# EAGLE design converter (EAGLE 7.4.0)
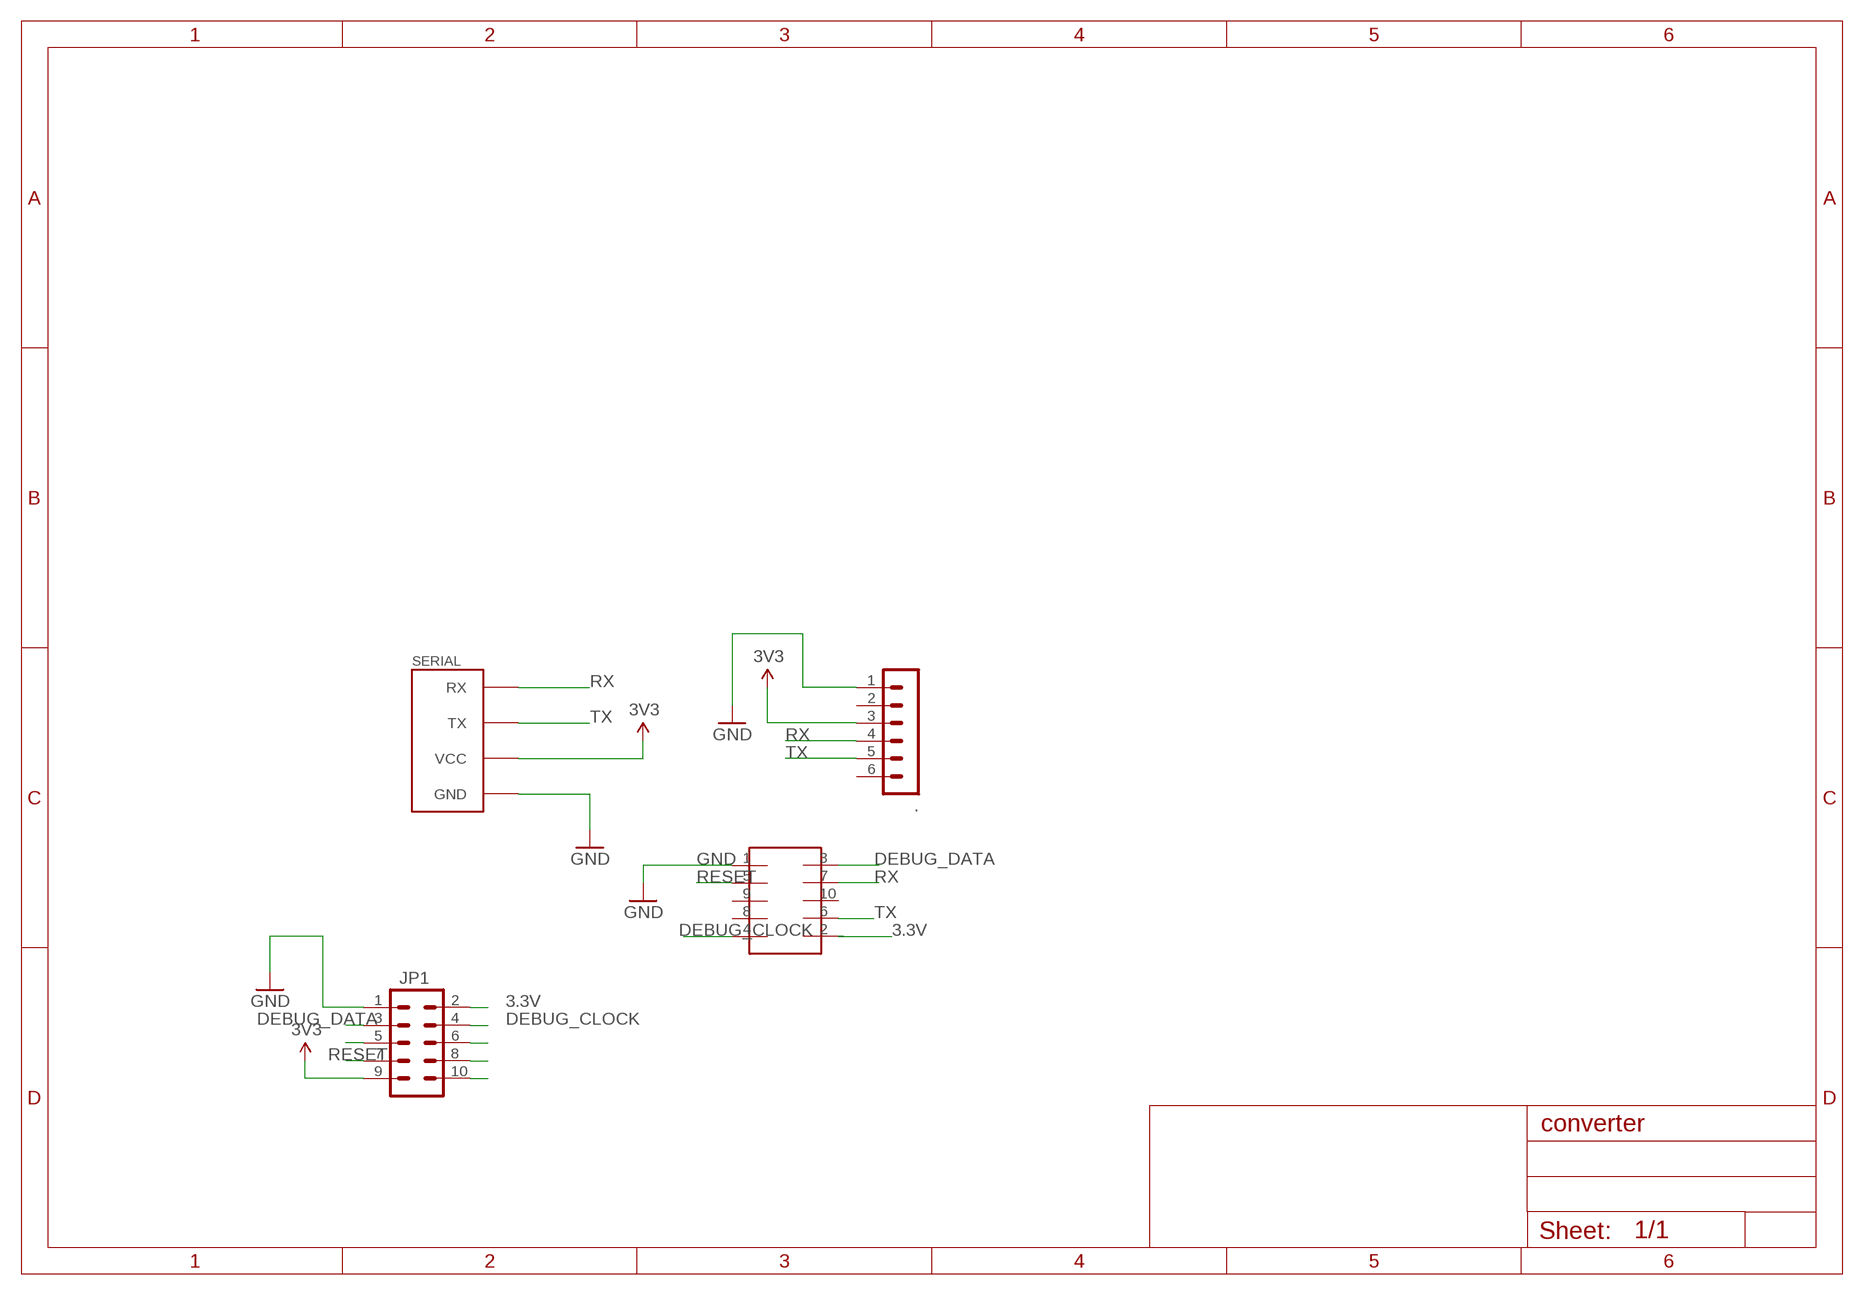
[diagram p0: schematic, sheet 1]

## Parts
.  MA06-1  [MA06-1]
JP1  M05X2SHD  [2X5-SHROUDED]
SERIAL  FABO_BRICK_SERIAL-CONNECTOR_I  [FABO_BRICK_SERIAL_CONNECTOR_I]
U$4  TC-2050-SOCKET  [TC-2050-SOCKET]

## Nets
3.3V: JP1.2 U$4.2
3V3: ..3 JP1.9 SERIAL.VCC
CSN: JP1.5
DEBUG_CLOCK: JP1.4 U$4.4
DEBUG_DATA: JP1.3 U$4.3
GND: ..1 JP1.1 SERIAL.GND U$4.1
MISO: JP1.10
MOSI: JP1.8
RESET: JP1.7 U$4.5
RX: ..4 SERIAL.RX U$4.7
SCLK: JP1.6
TX: ..5 SERIAL.TX U$4.6
Unconnected: ..2 ..6 U$4.8 U$4.9 U$4.10

## Library data of the parts
. = con-lstb:MA06-1: PIN HEADER; OC_FARNELL: unknown; OC_NEWARK: unknown
JP1 = SparkFun-Connectors:M05X2: Header 5x2 Standard 10-pin dual row 0.1" header. Commonly used with AVR-ISP. Use with Spark Fun Electronics SKU: PRT-00778
SERIAL = FaBo-Template:FABO_BRICK_SERIAL: FaBo Brick Serial
U$4 = GClue-Debbuger:TC-2050-SOCKET

## Board
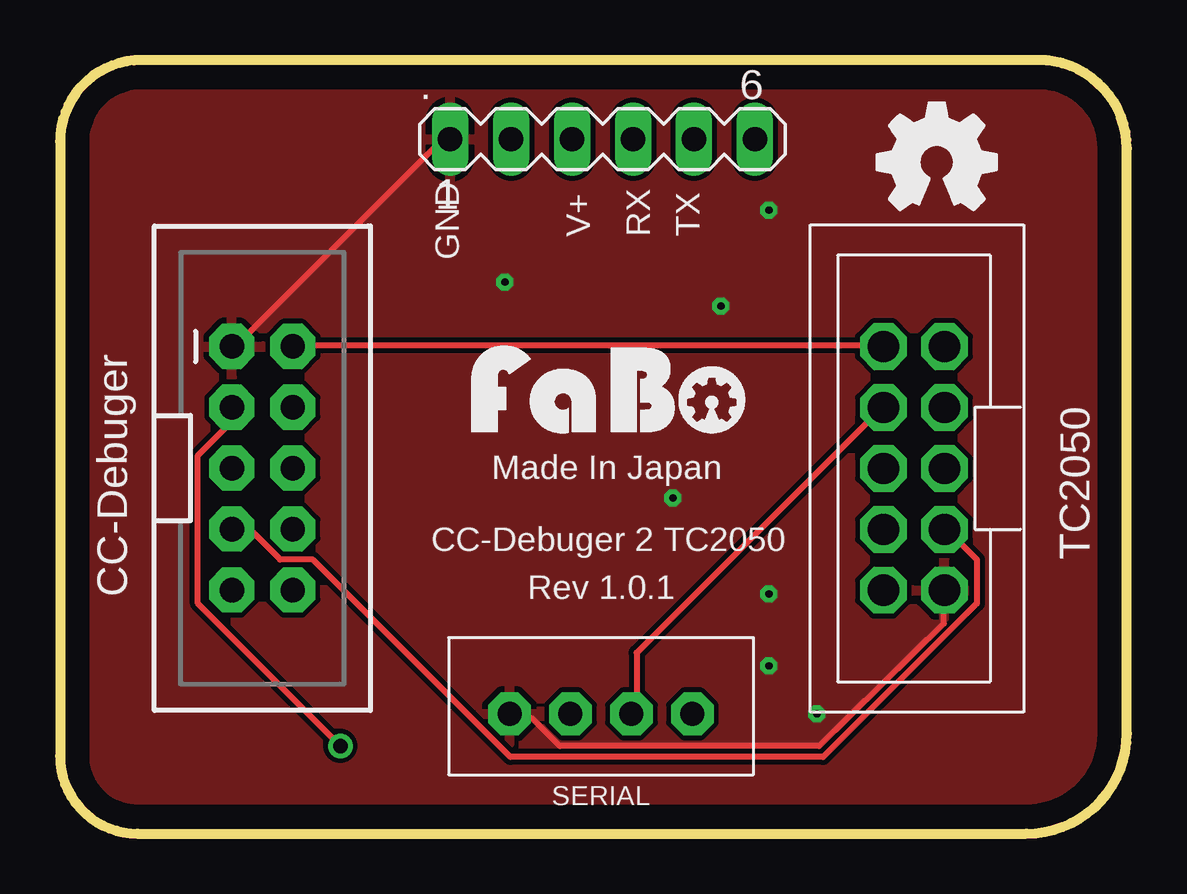
[diagram p1: board, top side]
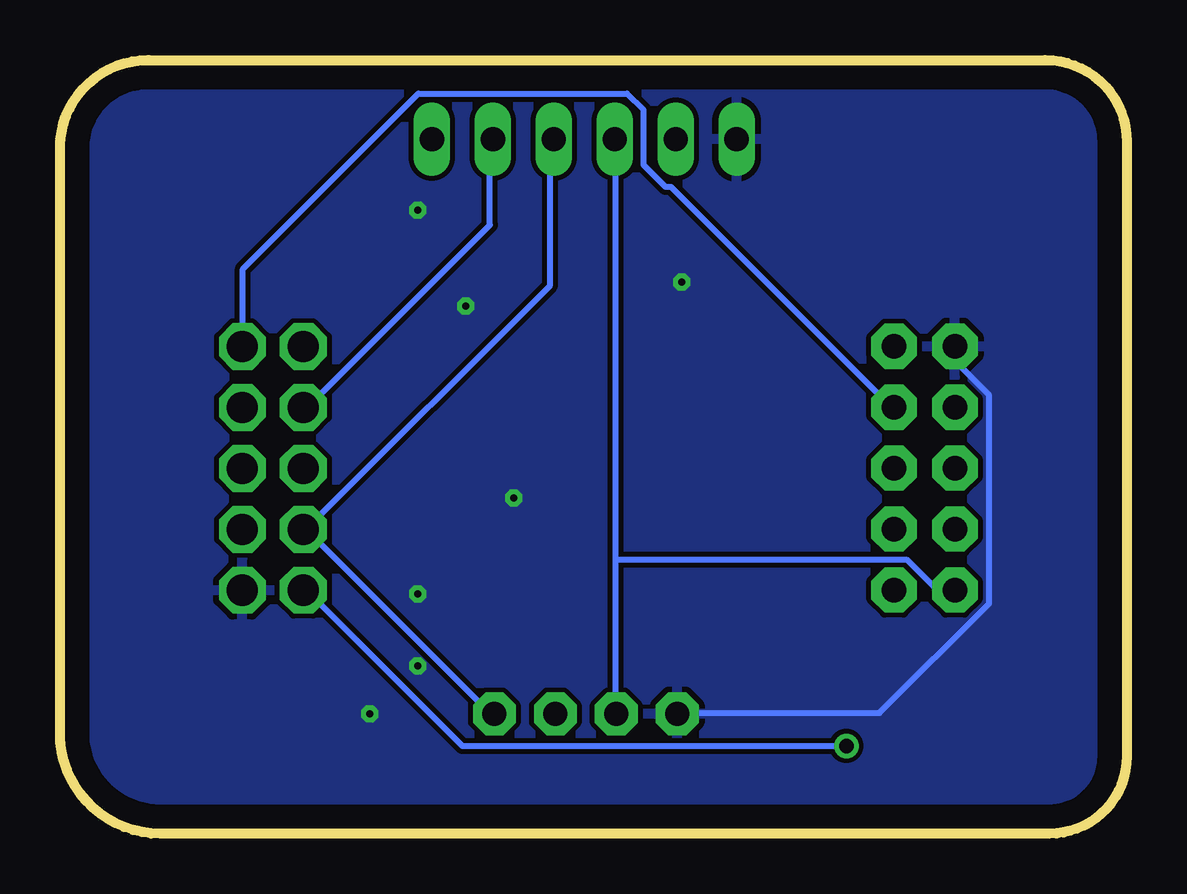
[diagram p2: board, bottom side, seen from below]

Size 44.45 x 32.26 mm. Coordinates in mm from the lower left corner, seen from the top.
Outline: 3.23,0 40.27,0 arc90 44.45,4.18 44.45,28.57 arc90 40.77,32.26 3.4,32.26 arc90 0,28.86 0,3.23 arc90 3.23,0
Copper layers (1*16): Top 0.035mm / dielectric 1.5mm / Bottom 0.035mm
Design rules "default": minimum track width 10mil, minimum drill 24mil, track to track 8mil, track to pad 8mil, pad to pad 8mil, via to via 8mil, smd to smd 8mil, copper to edge 40mil, drill to drill 8mil, minimum pad ring 10mil, minimum via ring 8mil, stop-mask expansion 4mil, vias tented up to drill 0mil, thermal gap 10mil

### Footprints (pad centres in the part's own frame; a part is rotated, then mirrored left to right if it is on the bottom)
MA06-1 = drill 1.016 long: 1 -6.35,0; 2 -3.81,0; 3 -1.27,0; 4 1.27,0; 5 3.81,0; 6 6.35,0
2X5-SHROUDED = drill 1.016 pad 1.88 octagon: 1 -1.27,5.08; 2 1.27,5.08; 3 -1.27,2.54; 4 1.27,2.54; 5 -1.27,0; 6 1.27,0; 7 -1.27,-2.54; 8 1.27,-2.54; 9 -1.27,-5.08; 10 1.27,-5.08
FABO_BRICK_SERIAL_CONNECTOR_I = drill 1 pad 1.778 octagon: GND -3.81,0; RX 3.81,0; TX 1.27,0; VCC -1.27,0
TC-2050-SOCKET = drill 1.3 octagon: 1 1.27,-8.89; 2 -1.27,1.27; 3 -1.27,-8.89; 4 1.27,1.27; 5 1.27,-6.35; 6 -1.27,-1.27; 7 -1.27,-6.35; 8 1.27,-1.27; 9 1.27,-3.81; 10 -1.27,-3.81

### Placement (x,y rotation side)
.  22.61,28.96 0 top
JP1  8.43,15.24 0 top
SERIAL  22.54,5 0 top
U$1  [LOGO_FABO_M]  22.86,16.7 0 top
U$2  [LOGO_OSHW_M]  36.54,28 0 top
U$4  35.58,19.04 0 top

### Tracks (layer width: path | path; a pad name or v marks a point on that pad's centre or on a via)
3.3V
  Top 0.254: JP1.2 9.86,20.34 34.09,20.34 U$4.2
3V3
  Bottom 0.254: 21.29,11.43 21.29,5.03 SERIAL.VCC | 21.29,11.43 21.29,28.8 ..3 | 21.29,11.43 9.17,11.43 8.03,10.29 7.34,10.29 JP1.9
DEBUG_CLOCK
  Bottom 0.254: JP1.4 9.86,17.83 19,26.98 19.23,26.98 20.14,27.89 20.14,30.18 20.83,30.86 29.52,30.86 36.83,23.55 36.83,20.34 U$4.4
DEBUG_DATA  (via drill 0.61)
  Top 0.254: v11.68,3.66 5.74,9.6 5.74,15.77 7.11,17.14 7.11,17.6 JP1.3
  Bottom 0.254: v11.68,3.66 27.69,3.66 34.09,10.06 U$4.3
GND  (via drill 0.3)
  Top 0.254: ..1 16.26,28.8 15.8,28.8 7.34,20.34 JP1.1 | SERIAL.GND 18.77,4.8 19.68,4.8 20.83,3.66 31.63,3.66 36.83,8.76 U$4.1
  Bottom 0.254: JP1.1 7.11,20.12 7.11,19.66 5.74,18.29 5.74,9.6 10.31,5.03 18.54,5.03 SERIAL.GND
  other vias: 18.54,23 25.54,14 27.54,22 29.54,26 29.54,10 29.54,7 31.54,5
  pour Top: -0.46,-1 44.54,-1 44.54,33 -0.46,33
  pour Bottom: -0.46,-1 44.54,-1 44.54,33 -0.46,33
RESET
  Top 0.254: JP1.7 7.34,12.57 8.03,12.57 9.17,11.43 10.54,11.43 18.77,3.2 31.8,3.2 38.2,9.6 38.2,11.43 37.06,12.57 U$4.5
RX
  Bottom 0.254: ..4 24.03,28.8 24.03,22.86 34.09,12.8 U$4.7 34.09,12.57 26.54,5.03 SERIAL.RX
TX
  Top 0.254: SERIAL.TX 24.03,5.03 24.03,7.54 34.09,17.6 U$4.6
  Bottom 0.254: ..5 26.54,28.8 26.54,25.38 34.09,17.83 U$4.6

### Text on the board
tPlace: V+ | RX | TX | GND | Made In Japan | CC-Debuger 2 TC2050 | TC2050 | CC-Debuger | Rev 1.0.1